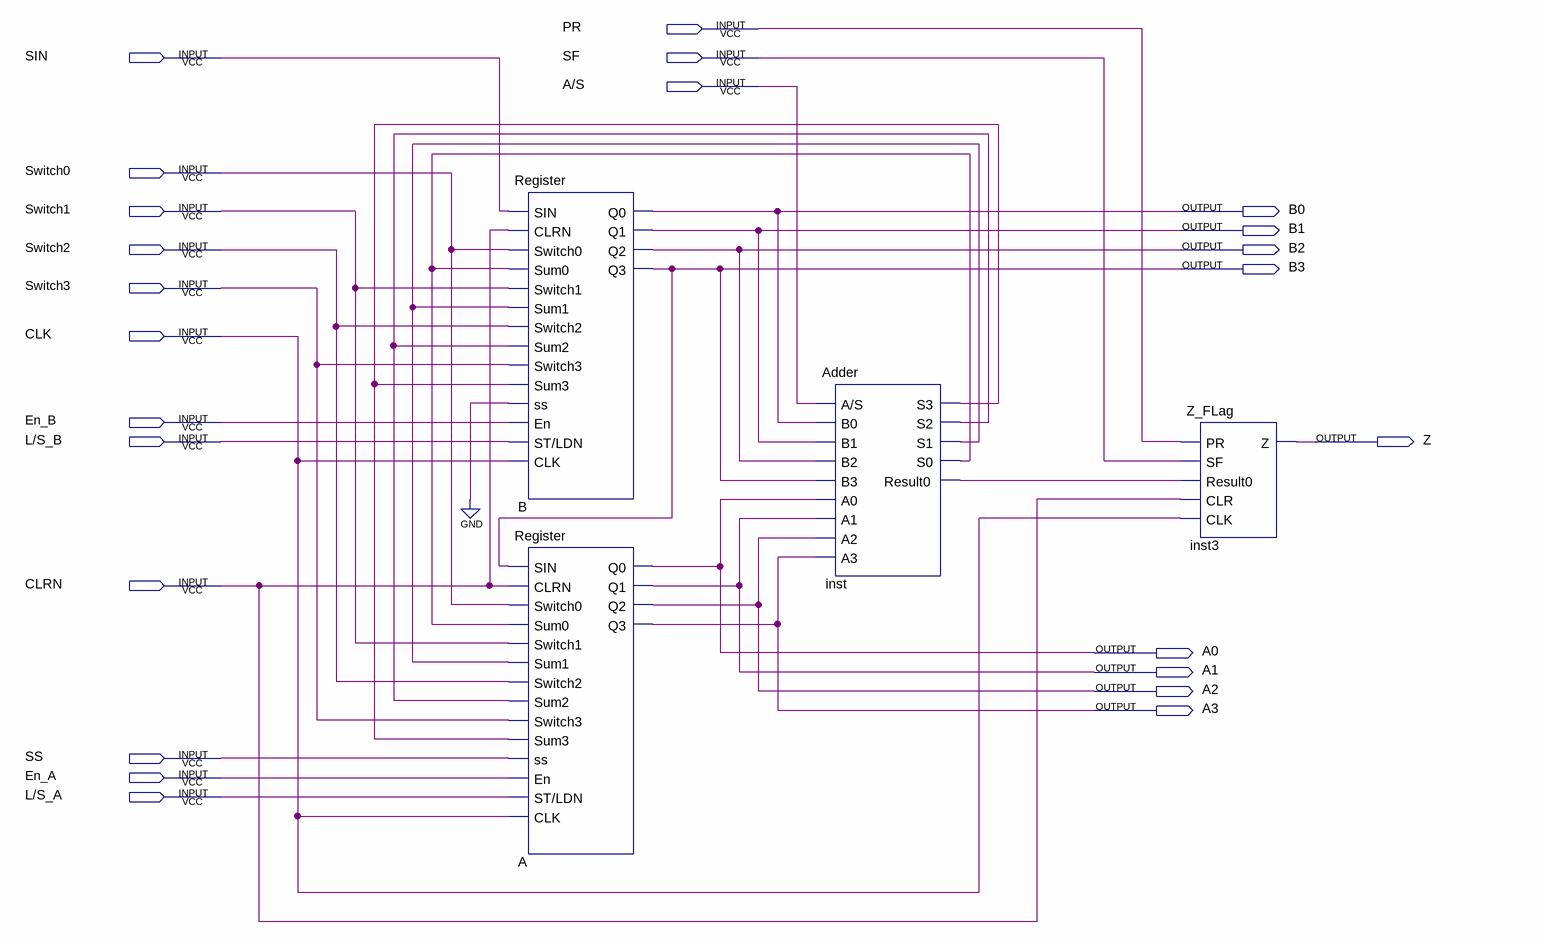
[diagram p0: schematic sheet]
// Quartus schematic Datapath.bdf as structural Verilog: 4 symbols, 24 pins
module Datapath (
  input  PR,
  input  SIN,
  input  SF,
  input  \A/S ,
  input  Switch0,
  input  Switch1,
  input  Switch2,
  input  Switch3,
  input  CLK,
  input  En_B,
  input  \L/S_B ,
  input  CLRN,
  input  SS,
  input  En_A,
  input  \L/S_A ,
  output B0,
  output B1,
  output B2,
  output B3,
  output Z,
  output A0,
  output A1,
  output A2,
  output A3
);

  wire inst_result0, inst_s0, inst_s1, inst_s2, inst_s3;

  Register B (
    .SIN(SIN), .CLRN(CLRN), .Switch0(Switch0), .Sum0(inst_s0), .Switch1(Switch1), .Sum1(inst_s1),
    .Switch2(Switch2), .Sum2(inst_s2), .Switch3(Switch3), .Sum3(inst_s3), .ss(1'b0), .En(En_B),
    .\ST/LDN (\L/S_B ), .CLK(CLK), .Q0(B0), .Q1(B1), .Q2(B2), .Q3(B3));
  Register A (
    .SIN(B3), .CLRN(CLRN), .Switch0(Switch0), .Sum0(inst_s0), .Switch1(Switch1), .Sum1(inst_s1),
    .Switch2(Switch2), .Sum2(inst_s2), .Switch3(Switch3), .Sum3(inst_s3), .ss(SS), .En(En_A),
    .\ST/LDN (\L/S_A ), .CLK(CLK), .Q0(A0), .Q1(A1), .Q2(A2), .Q3(A3));
  Adder inst (
    .\A/S (\A/S ), .B0(B0), .B1(B1), .B2(B2), .B3(B3), .A0(A0), .A1(A1), .A2(A2), .A3(A3), .S3(inst_s3),
    .S2(inst_s2), .S1(inst_s1), .S0(inst_s0), .Result0(inst_result0));
  Z_FLag inst3 (.PR(PR), .SF(SF), .Result0(inst_result0), .CLR(CLRN), .CLK(CLK), .Z(Z));
endmodule
